# Altium project ACDC_Flyback.PrjPcb
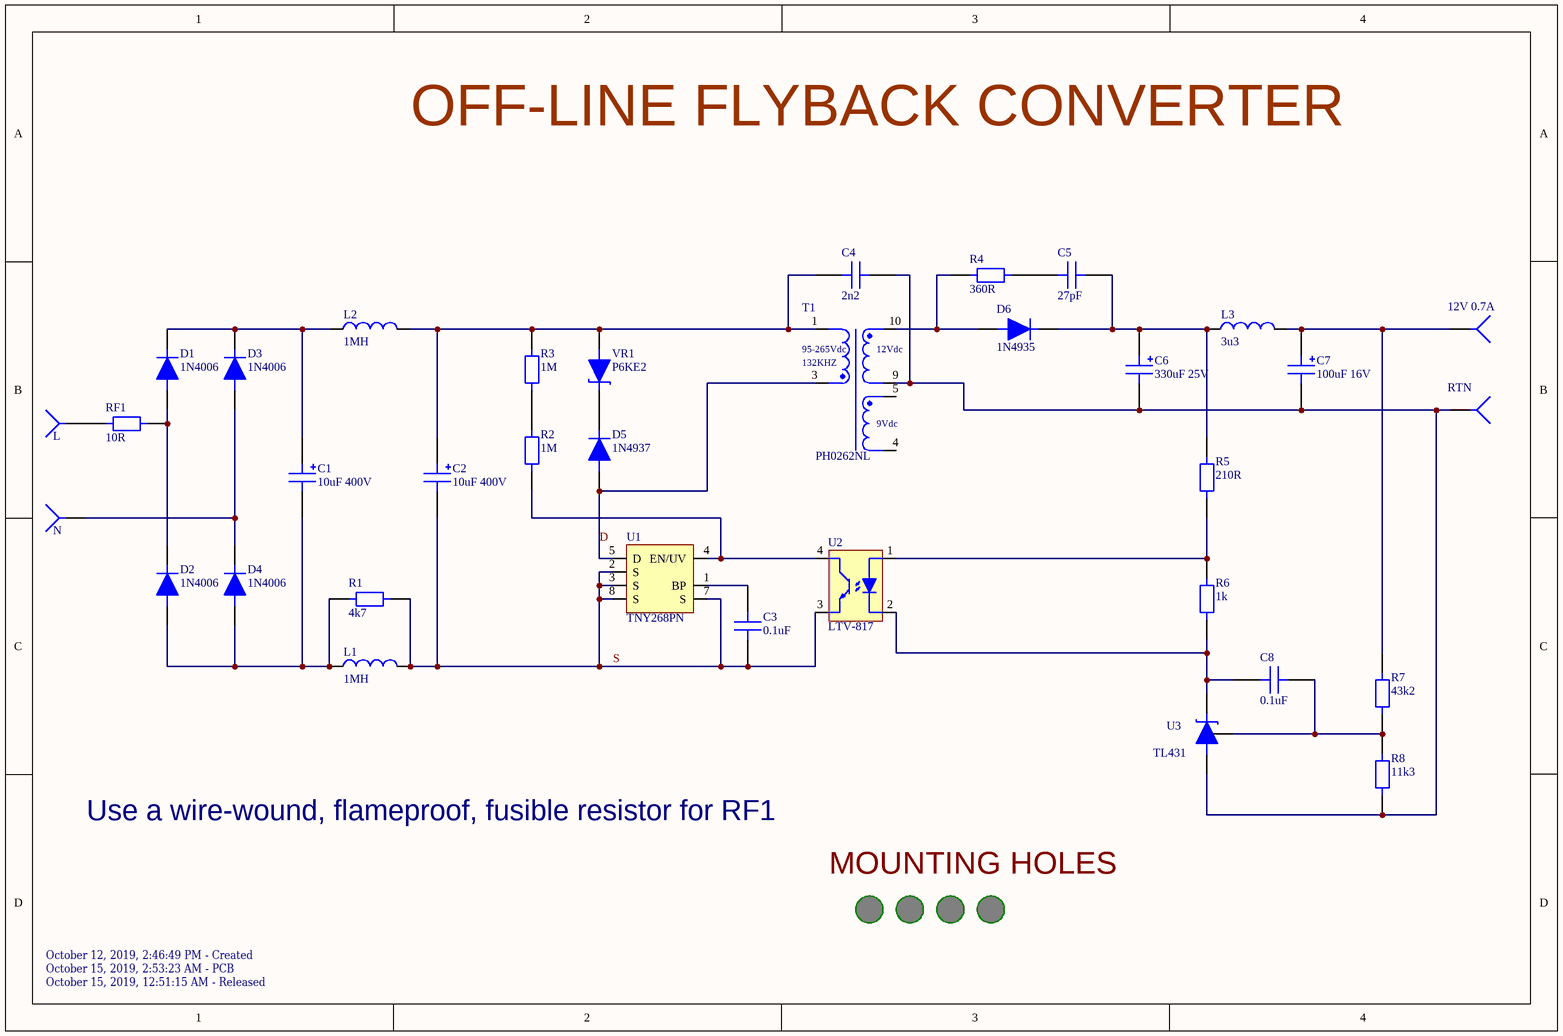
[diagram p0: ACDC_Flyback.SchDoc]
2 sheets, 39 parts. Net scope: global (net labels, ports and power ports of the same name join across sheets).
Board file: ACDC_Flyback.PcbDoc
Sheets:
  ACDC_Flyback.SchDoc
  Board Layout Recommendations.SchDoc

## Sheet ACDC_Flyback.SchDoc
size A4

### Parts
1  MNT HOLE 3.5mm  [MNT HOLE 3.5mm]  (value not drawn)  (no BOM)
2  MNT HOLE 3.5mm  [MNT HOLE 3.5mm]  (value not drawn)  (no BOM)
3  MNT HOLE 3.5mm  [MNT HOLE 3.5mm]  (value not drawn)  (no BOM)
4  MNT HOLE 3.5mm  [MNT HOLE 3.5mm]  (value not drawn)  (no BOM)
C1  10uF 400V  [CAP 10x20]
C2  10uF 400V  [CAP 10x20]
C3  0.1uF  [CAP CER 5mm]
C4  2n2  [CAP X1/Y1 9.5mm]
C5  27pF  [CAP CER 5mm]
C6  330uF 25V  [CAP 8x16]
C7  100uF 16V  [CAP 5x11]
C8  0.1uF  [CAP CER 5mm]
D1  1N4006  [Diode H 8.5mm]
D2  1N4006  [Diode H 8.5mm]
D3  1N4006  [Diode H 8.5mm]
D4  1N4006  [Diode H 8.5mm]
D5  1N4937  [Diode H 8.5mm]
D6  1N4935  [Diode H 8.5mm]
L1  1MH  [IND 4mm BLUE]
L2  1MH  [IND 4mm BLUE]
L3  3u3  [IND 4mm BLACK]
R1  4k7  [RES V 0.25W 5mm]
R2  1M  [RES H 0.25W 8.5mm]
R3  1M  [RES H 0.25W 8.5mm]
R4  360R  [RES V 0.25W 5mm]
R5  210R  [RES V 0.25W 5mm]
R6  1k  [RES V 0.25W 5mm]
R7  43k2  [RES V 0.25W 5mm]
R8  11k3  [RES V 0.25W 5mm]
RF1  10R  [RES V 2W 5mm]
T1  PH0262NL  [PH0262NL]
U1  TNY268PN  [DIP8]
U2  LTV-817  [LTV-8x7]
U3  TL431  [TO-92 (TO-226)]
VR1  P6KE2  [Diode H 8.5mm]
X1  L  [Power Terminal]  (no BOM)
X2  N  [Power Terminal]  (no BOM)
X3  12V 0.7A  [Power Terminal]  (no BOM)
X4  RTN  [Power Terminal]  (no BOM)

### Nets
D: D5.1 T1.3 U1.5(D)
S: C2.1 C3.1 L1.2 R1.2 U1.2(S) U1.3(S) U1.7(S) U1.8(S) U2.3
NetC1_1: C1.1 D2.1 D4.1 L1.1 R1.1
NetC1_2: C1.2 D1.2 D3.2 L2.1
NetC2_2: C2.2 C4.1 L2.2 R3.2 T1.1 VR1.1
NetC3_2: C3.2 U1.1(BP)
NetC4_2: C4.2 C6.1 C7.1 R8.1 T1.9 U3.2 X4.1
NetC5_1: C5.1 R4.2
NetC5_2: C5.2 C6.2 D6.2 L3.1 R5.1
NetC7_2: C7.2 L3.2 R7.2 X3.1
NetC8_1: C8.1 R6.1 U2.2 U3.3
NetC8_2: C8.2 R7.1 R8.2 U3.1
NetD1_1: D1.1 D2.2 RF1.2
NetD3_1: D3.1 D4.2 X2.1
NetD5_2: D5.2 VR1.2
NetD6_1: D6.1 R4.1 T1.10
NetR2_1: R2.1 U1.4(EN/UV) U2.4
NetR2_2: R2.2 R3.1
NetR5_2: R5.2 R6.2 U2.1
NetRF1_1: RF1.1 X1.1

Not connected (* = marked no-connect by the designer): T1 4 5

### Notes on the sheet
- OFF-LINE FLYBACK CONVERTER
- Use a wire-wound, flameproof, fusible resistor for RF1
- MOUNTING HOLES
- ‎October ‎12, ‎2019, ‏‎2:46:49 PM - Created
- ‎October ‎15, ‎2019, ‏‎2:53:23 AM - PCB
- ‎October ‎15, ‎2019, ‏‎12:51:15 AM - Released
- (in symbol PH0262NL) 95-265Vdc; 12Vdc; 132KHZ; 9Vdc

### Library data of the parts
C1 C2 = EKXG401ETD100MJ20S: CAP ALUM 10uF 400V 10x20; Manufacturer: United Chemi-Con; Tolerance: 20%; Ripple Current: 140mA; Polarity: Polar; Life (Hours): 8000Hour; Supplier 1: Digi-Key; Supplier Part Number 1: 565-4257-1-ND; Manufacturer Part Number: EKXG401ETD100MJ20S; Stock 1: 3749; Mount: Through Hole; Case/Package: Radial; Min Operating Temperature: -40°C; Max Operating Temperature: 105°C; Package Quantity: 800; Packaging: Tape and Reel; Capacitance: 10uF; Voltage Rating: 400V; Termination: Radial; Length: 20mm; Lead Pitch: 5mm; Height - Seated (Max): 0.846inch; ComponentLink1URL: http://www.chemi-con.co.jp/cgi-bin/CAT_DB/SEARCH/cat_db_al.cgi?e=e&j=p&pdfname=kxg&src-supplier=Digi-Key; ComponentLink1Description: http://www.chemi-con.co.jp/cgi-bin/CAT_DB/SEARCH/cat_db_al.cgi?e=e&j=p&pdfname=kxg&src-supplier=Digi-Key; ComponentLink2URL: http://www.onlinecomponents.com/datasheet/ekxg401etd100mj20s.aspx?p=12708479&src-supplier=Onlinecomponents.com; ComponentLink2Description: http://www.onlinecomponents.com/datasheet/ekxg401etd100mj20s.aspx?p=12708479&src-supplier=Onlinecomponents.com; ComponentLink3URL: http://www.mouser.com/ds/2/420/-794782.pdf?src-supplier=Mouser; ComponentLink3Description: http://www.mouser.com/ds/2/420/-794782.pdf?src-supplier=Mouser; Category: Capasitors
C3 C8 = K104K15X7RF5TL2: CAP CER 0.1UF 50V X7R RADIAL; Manufacturer: Vishay BCcomponents; Dielectric Material: Ceramic; Capacitance: 100nF; Tolerance: 10%; Lead/Base Style: Straight; Lead Diameter: 0.5mm; Lead Length: 30mm; Supplier 1: Digi-Key; Supplier Part Number 1: BC1084CT-ND; Manufacturer Part Number: K104K15X7RF5TL2; Stock 1: 40474; Mount: Through Hole,PCB; Case/Package: Dipped; Number of Pins: 2; Weight: 0.005291oz; Contact Plating: Tin; Min Operating Temperature: -55°C; Max Operating Temperature: 125°C; Voltage Rating: 50V; Package Quantity: 4000; Packaging: Tape and Reel; Dielectric: X7R; Voltage Rating (DC): 50V; Termination: Radial; Voltage: 50V; Diameter: 500um; Length: 4mm; Height: 4mm; Width: 0.098inch; Lead Pitch: 2.5mm; Height - Seated (Max): 0.22inch; Depth: 2.6mm; Thickness: 2.6mm; Radiation Hardening: No; REACH SVHC: Unknown; Lead Free: Lead Free; ComponentLink1URL: http://www.vishay.com/docs/45171/kseries.pdf?src-supplier=Digi-Key; ComponentLink1Description: http://www.vishay.com/docs/45171/kseries.pdf?src-supplier=Digi-Key; ComponentLink2URL: http://components.arrow.com/part/dataview/4566668S9851583N4052?src-supplier=Arrow; ComponentLink2Description: http://components.arrow.com/part/dataview/4566668S9851583N4052?src-supplier=Arrow; ComponentLink3URL: http://www.mouser.com/ds/2/427/kvseries-1097555.pdf?src-supplier=Mouser; ComponentLink3Description: http://www.mouser.com/ds/2/427/kvseries-1097555.pdf?src-supplier=Mouser; ComponentLink4URL: https://www.alliedelec.com/m/d/0a55132c315b03541979b2302407a53b.pdf?src-supplier=Allied+Electronics; ComponentLink4Description: https://www.alliedelec.com/m/d/0a55132c315b03541979b2302407a53b.pdf?src-supplier=Allied+Electronics; ComponentLink5URL: https://www.verical.com/server-webapp/html/getDatasheet?partID=35651&src-supplier=Verical; ComponentLink5Description: https://www.verical.com/server-webapp/html/getDatasheet?partID=35651&src-supplier=Verical; ComponentLink6URL: http://www.farnell.com/datasheets/2608733.pdf?src-supplier=Farnell; ComponentLink6Description: http://www.farnell.com/datasheets/2608733.pdf?src-supplier=Farnell; ComponentLink7URL: http://www.farnell.com/datasheets/2045807.pdf?src-supplier=Element14; ComponentLink7Description: http://www.farnell.com/datasheets/2045807.pdf?src-supplier=Element14; Category: Capacitors
C4 = 440LD22-R: CAP CER 2u2 X1/Y1 400VAC/500VAC Y5U 20% (10.9 X 5.7mm) Radial 9.5mm Bulk; Manufacturer: Vishay; Capacitance: 2.2nF; Voltage Rating (AC): 500V; Dissipation Factor: 2%; Lead/Base Style: Straight; Lead Diameter: 0.81mm; Ratings: X1,Y1; Supplier 1: Digi-Key; Supplier Part Number 1: BC3229-ND; Manufacturer Part Number: 440LD22-R; Stock 1: 0; Mount: Through Hole,PCB; Case/Package: Radial; Contact Plating: Tin; Min Operating Temperature: -30°C; Max Operating Temperature: 125°C; Tolerance: 20%; Dielectric: Y5U; Package Quantity: 250; Termination: Radial; Packaging: Bulk; Composition: Ceramic; Voltage: 500V; Diameter: 10.9mm; Height: 5.7mm; Lead Pitch: 9.5mm; Height - Seated (Max): 0.555inch; Depth: 5.7mm; Radiation Hardening: No; Lead Free: Lead Free; ComponentLink1URL: https://www.alliedelec.com/m/d/8418b65e1fb6842b96172f5a3b1dd544.pdf?src-supplier=Allied+Electronics; ComponentLink1Description: https://www.alliedelec.com/m/d/8418b65e1fb6842b96172f5a3b1dd544.pdf?src-supplier=Allied+Electronics; ComponentLink2URL: https://www.verical.com/server-webapp/html/getDatasheet?partID=310202&src-supplier=Verical; ComponentLink2Description: https://www.verical.com/server-webapp/html/getDatasheet?partID=310202&src-supplier=Verical; ComponentLink3URL: http://www.vishay.com/docs/23102/440lseries.pdf?src-supplier=Digi-Key; ComponentLink3Description: http://www.vishay.com/docs/23102/440lseries.pdf?src-supplier=Digi-Key; ComponentLink4URL: http://www.mouser.com/ds/2/427/440lseries-239711.pdf?src-supplier=Mouser; ComponentLink4Description: http://www.mouser.com/ds/2/427/440lseries-239711.pdf?src-supplier=Mouser; Category: Capacitors
C5 = RCE5C2A270J0M1H03A: CAP CER 27pF 100V C0G/NP0 RADIAL; Manufacturer: Murata; Tolerance: 5%; Dielectric: C0G; Lead/Base Style: Formed Leads; Lead Diameter: 0.5mm; Supplier 1: Digi-Key; Supplier Part Number 1: 490-7451-1-ND; Manufacturer Part Number: RCE5C2A270J0M1H03A; Stock 1: 7163; Mount: Through Hole; Case/Package: Radial; Min Operating Temperature: -55°C; Max Operating Temperature: 125°C; Capacitance: 27pF; Voltage Rating (DC): 100V; Package Quantity: 2000; Packaging: Tape and Reel; Voltage Rating: 100V; Termination: Radial; Composition: Ceramic; Length: 0.142inch; Height: 3.5mm; Width: 0.098inch; Lead Pitch: 0.197inch; Height - Seated (Max): 0.138inch; Ratings: AEC-Q200; ComponentLink1URL: http://search.murata.co.jp/Ceramy/image/img/A01X/CNRPEE.pdf?src-supplier=Digi-Key; ComponentLink1Description: http://search.murata.co.jp/Ceramy/image/img/A01X/CNRPEE.pdf?src-supplier=Digi-Key; Category: Capasitors
C6 = ESY337M025AG8AA: CAP ALUM 330uF 25V 20% 105C Radial 8x16 Aluminum Electrolytic Capacitors; Manufacturer: KEMET; Dielectric Material: Aluminium; Ripple Current: 700mA; Impedance: 56mR; Leakage Current: 82uA; Life (Hours): 3000Hour; Dissipation Factor: 0.14%; Lead/Base Style: Straight; Lead Diameter: 0.6mm; Lead Length: 20mm; Supplier 1: Digi-Key; Supplier Part Number 1: 399-6125-ND; Manufacturer Part Number: ESY337M025AG8AA; Stock 1: 2532; Mount: Through Hole,PCB; Case/Package: Radial; Min Operating Temperature: -40°C; Max Operating Temperature: 105°C; Capacitance: 330uF; Tolerance: 20%; Package Quantity: 5000; Voltage Rating: 25V; Packaging: Bulk; Voltage Rating (DC): 25V; Termination: Radial; Voltage: 25V; ESR (Equivalent Series Resistance): 56mR; Diameter: 8mm; Length: 16mm; Height: 16mm; Lead Pitch: 3.5mm; Height - Seated (Max): 0.709inch; Radiation Hardening: No; ComponentLink1URL: http://capacitoredge.kemet.com/capedge2/DataSheet?pn=ESY337M025AG8AA&src-supplier=Avnet; ComponentLink1Description: http://capacitoredge.kemet.com/capedge2/DataSheet?pn=ESY337M025AG8AA&src-supplier=Avnet; ComponentLink2URL: http://uk.rs-online.com/webdocs/1443/0900766b81443d12.pdf?src-supplier=RSComponents; ComponentLink2Description: http://uk.rs-online.com/webdocs/1443/0900766b81443d12.pdf?src-supplier=RSComponents; ComponentLink3URL: https://search.kemet.com/component-edge/download/specsheet/ESY337M025AG8AA.pdf?src-supplier=Digi-Key; ComponentLink3Description: https://search.kemet.com/component-edge/download/specsheet/ESY337M025AG8AA.pdf?src-supplier=Digi-Key; ComponentLink4URL: http://capacitoredge.kemet.com/capedge2/DataSheet?pn=ESY337M025AG8AA&src-supplier=Avnet+Europe; ComponentLink4Description: http://capacitoredge.kemet.com/capedge2/DataSheet?pn=ESY337M025AG8AA&src-supplier=Avnet+Europe; ComponentLink5URL: https://www.alliedelec.com/m/d/e4a14f479f712247b3f3335e27a86e2b.pdf?src-supplier=Allied+Electronics; ComponentLink5Description: https://www.alliedelec.com/m/d/e4a14f479f712247b3f3335e27a86e2b.pdf?src-supplier=Allied+Electronics; ComponentLink6URL: http://www.mouser.com/ds/2/212/KEM_A4007_ESY-1103537.pdf?src-supplier=Mouser; ComponentLink6Description: http://www.mouser.com/ds/2/212/KEM_A4007_ESY-1103537.pdf?src-supplier=Mouser; Category: Capacitors
C7 = ESL107M016AC3AA: CAP ALUM 100UF 16V 20% THRU HOLE; Manufacturer: KEMET; Polarity: Polar; ESR (Equivalent Series Resistance): 230mR; Life (Hours): 8000Hour; Supplier 1: Digi-Key; Supplier Part Number 1: 399-15740-ND; Manufacturer Part Number: ESL107M016AC3AA; Stock 1: 28659; Mount: Through Hole; Case/Package: Radial; Min Operating Temperature: -40°C; Max Operating Temperature: 105°C; Packaging: Bulk; Capacitance: 100uF; Tolerance: 20%; Voltage Rating: 16V; ComponentLink1URL: https://api.kemet.com/component-edge/download/datasheet/ESL107M016AC3AA.pdf?src-supplier=Digi-Key; ComponentLink1Description: https://api.kemet.com/component-edge/download/datasheet/ESL107M016AC3AA.pdf?src-supplier=Digi-Key; Category: Capacitors
D1-D4 = 1N4006E354: DIODE 1N4006 GEN PURP 800V 1A DO204AL; Manufacturer: Vishay Intertechnology; Forward Voltage: 1.1V; Peak Non-Repetitive Surge Current: 45A; Element Configuration: Single; Polarity: Standard; Capacitance: 15pF; Supplier 1: Digi-Key; Supplier Part Number 1: 1N4006-E3/54GITR-ND; Manufacturer Part Number: 1N4006E354; Stock 1: 0; Mount: Through Hole; Number of Pins: 2; Min Operating Temperature: -50°C; Max Operating Temperature: 150°C; Packaging: Tape and Reel; Voltage Rating (DC): 800V; Current Rating: 1A; Output Current: 1A; Radiation Hardening: No; Lead Free: Lead Free; ComponentLink1URL: https://www.verical.com/server-webapp/html/getDatasheet?partID=770984&src-supplier=Verical; ComponentLink1Description: https://www.verical.com/server-webapp/html/getDatasheet?partID=770984&src-supplier=Verical; Category: Diodes
D5 = 1N4937GP-E3/73: DIODE 1N4937 Rectifiers 1.0 Amp 600 Volt Glass Passivated; Manufacturer: Vishay Semiconductors; Peak Reverse Current: 5uA; Max Surge Current: 30A; Recovery Time: 200ns; Average Rectified Current: 1A; Max Repetitive Reverse Voltage (Vrrm): 600V; Element Configuration: Single; Supplier 1: Digi-Key; Supplier Part Number 1: 1N4937GP-E3/73GICT-ND; Manufacturer Part Number: 1N4937GP-E3/73; Stock 1: 12000; Mount: Through Hole; Number of Pins: 2; Contact Plating: Tin,Matte; Min Operating Temperature: -65°C; Max Operating Temperature: 175°C; Packaging: Tape and Reel; Package Quantity: 3000; Reverse Recovery Time: 200ns; Peak Non-Repetitive Surge Current: 30A; Reverse Voltage: 600V; Max Reverse Voltage (DC): 600V; Radiation Hardening: No; ComponentLink1URL: http://www.vishay.com/docs/88509/1n4933gp.pdf?src-supplier=Avnet+Europe; ComponentLink1Description: http://www.vishay.com/docs/88509/1n4933gp.pdf?src-supplier=Avnet+Europe; ComponentLink2URL: http://www.vishay.com/docs/88509/1n4933gp.pdf?src-supplier=Digi-Key; ComponentLink2Description: http://www.vishay.com/docs/88509/1n4933gp.pdf?src-supplier=Digi-Key; Category: Diodes
D6 = 1N4935-E3/54: DIODE 1N4935 Rectifiers 1.0 Amp 200 Volt; Manufacturer: Vishay Semiconductors; Max Surge Current: 30A; Recovery Time: 200ns; Forward Voltage: 1.2V; Forward Current: 1A; Peak Reverse Current: 5uA; Max Repetitive Reverse Voltage (Vrrm): 200V; Element Configuration: Single; Supplier 1: Digi-Key; Supplier Part Number 1: 1N4935-E3/54GICT-ND; Manufacturer Part Number: 1N4935-E3/54; Stock 1: 13746; Mount: Through Hole; Number of Pins: 2; Min Operating Temperature: -50°C; Max Operating Temperature: 150°C; Package Quantity: 1; Packaging: Tape and Reel; Average Rectified Current: 1A; Reverse Recovery Time: 200ns; Max Forward Surge Current (Ifsm): 30A; Peak Non-Repetitive Surge Current: 30A; Current: 1A; Voltage: 200V; Reverse Voltage: 200V; Max Reverse Voltage (DC): 200V; Diameter: 2.7mm; Length: 0.204inch; Radiation Hardening: No; REACH SVHC: Unknown; Lead Free: Lead Free; ComponentLink1URL: http://www.vishay.com/docs/88508/1n4933.pdf?src-supplier=Digi-Key; ComponentLink1Description: http://www.vishay.com/docs/88508/1n4933.pdf?src-supplier=Digi-Key; ComponentLink2URL: https://www.verical.com/server-webapp/html/getDatasheet?partID=249870&src-supplier=Verical; ComponentLink2Description: https://www.verical.com/server-webapp/html/getDatasheet?partID=249870&src-supplier=Verical; ComponentLink3URL: http://www.vishay.com/docs/88508/1n4933.pdf?src-supplier=Future+Electronics; ComponentLink3Description: http://www.vishay.com/docs/88508/1n4933.pdf?src-supplier=Future+Electronics; ComponentLink4URL: https://www.alliedelec.com/m/d/1dbe1470819963bfa21f0af49fac4c8c.pdf?src-supplier=Allied+Electronics; ComponentLink4Description: https://www.alliedelec.com/m/d/1dbe1470819963bfa21f0af49fac4c8c.pdf?src-supplier=Allied+Electronics; ComponentLink5URL: http://www.vishay.com/docs/88508/1n4933.pdf?src-supplier=Avnet; ComponentLink5Description: http://www.vishay.com/docs/88508/1n4933.pdf?src-supplier=Avnet; ComponentLink6URL: http://www.vishay.com/docs/88508/1n4933.pdf?src-supplier=Avnet+Europe; ComponentLink6Description: http://www.vishay.com/docs/88508/1n4933.pdf?src-supplier=Avnet+Europe; Category: Diodes
L1 L2 = SBC2-102-181: IND 1MH 180MA 4 OHM TH; Manufacturer: KEMET; Core Material: Ferrite; DC Resistance (DCR): 4R; Test Frequency: 10kHz; Tolerance: 10%; Saturation Current: 210mA; Shielding: Unshielded; Supplier 1: Digi-Key; Supplier Part Number 1: 399-18899-ND; Manufacturer Part Number: SBC2-102-181; Stock 1: 0; Mount: Through Hole; Case/Package: Radial; Packaging: Bulk; Inductance: 1mH; Composition: Wirewound; Current Rating: 180mA; Height - Seated (Max): 0.413inch; ComponentLink1URL: http://www.kemet.com/Lists/ProductCatalog/Attachments/606/KEM_L9007_SBC.pdf?src-supplier=Digi-Key; ComponentLink1Description: http://www.kemet.com/Lists/ProductCatalog/Attachments/606/KEM_L9007_SBC.pdf?src-supplier=Digi-Key; Category: Inductors
L3 = RL622-3R3K-RC: IND 3u3 5.5A 25 MOHM TH; Manufacturer: Bourns; Core Material: Ferrite; Self Resonant Frequency: 79MHz; Tolerance: 10%; Q Factor: 20; Inductance: 3.3uH; Shielding: Unshielded; DC Resistance (DCR): 25mR; Test Frequency: 7.96MHz; Lead/Base Style: Radial; Lead Diameter: 0.62mm; Lead Length: 5mm; Supplier 1: Digi-Key; Supplier Part Number 1: M9978-ND; Manufacturer Part Number: RL622-3R3K-RC; Stock 1: 14097; Mount: Through Hole,Radial; Case/Package: Radial; Number of Pins: 2; Min Operating Temperature: -55°C; Max Operating Temperature: 105°C; Packaging: Bulk; Package Quantity: 100; Termination: Radial; Orientation: Vertical; Inductance Tolerance: 10%; Current Rating: 5.5A; Max DC Current: 5.5A; Composition: Wirewound; DC Current: 5.5A; Military Standard: Not; RMS Current (Irms): 5.5A; Diameter: 8.5mm; Height: 11mm; Width: 8.5mm; Lead Pitch: 5mm; Height - Seated (Max): 0.433inch; Radiation Hardening: No; Lead Free: Lead Free; REACH SVHC: No SVHC; ComponentLink1URL: http://www.mouser.com/ds/2/54/RL622_series-38677.pdf?src-supplier=Mouser; ComponentLink1Description: http://www.mouser.com/ds/2/54/RL622_series-38677.pdf?src-supplier=Mouser; ComponentLink2URL: http://www.bourns.com/data/global/pdfs/rl622_series.pdf?src-supplier=Avnet; ComponentLink2Description: http://www.bourns.com/data/global/pdfs/rl622_series.pdf?src-supplier=Avnet; ComponentLink3URL: http://www.farnell.com/datasheets/1695387.pdf?src-supplier=Element14; ComponentLink3Description: http://www.farnell.com/datasheets/1695387.pdf?src-supplier=Element14; ComponentLink4URL: http://www.bourns.com/data/global/pdfs/rl622_series.pdf?src-supplier=Avnet+Europe; ComponentLink4Description: http://www.bourns.com/data/global/pdfs/rl622_series.pdf?src-supplier=Avnet+Europe; ComponentLink5URL: http://uk.rs-online.com/webdocs/0fa5/0900766b80fa594f.pdf?src-supplier=RSComponents; ComponentLink5Description: http://uk.rs-online.com/webdocs/0fa5/0900766b80fa594f.pdf?src-supplier=RSComponents; ComponentLink6URL: https://www.bourns.com/docs/Product-Datasheets/rl622_series.pdf?src-supplier=Digi-Key; ComponentLink6Description: https://www.bourns.com/docs/Product-Datasheets/rl622_series.pdf?src-supplier=Digi-Key; Category: Inductors
R1 = CFR-25JB-52-4K7: RES T/H 4k7 OHM 1/4W 5% AXIAL; Manufacturer: Yageo; Resistance: 4.7kR; Power Rating: 250mW; Temperature Coefficient: 500ppm/°C; Supplier 1: Digi-Key; Supplier Part Number 1: 4.7KQBK-ND; Manufacturer Part Number: CFR-25JB-52-4K7; Stock 1: 133689; Case/Package: Axial; Min Operating Temperature: -55°C; Max Operating Temperature: 155°C; Tolerance: 5%; Package Quantity: 200; Packaging: Bulk; Composition: Carbon Film; Number of Terminations: 2; Max Power Dissipation: 250mW; Length: 0.248inch; Lead Free: Lead Free; ComponentLink1URL: http://www.yageo.com/NewPortal/yageodocoutput?fileName=/pdf/throughhole/Yageo_LR_CFR_2013.pdf&src-supplier=Digi-Key; ComponentLink1Description: http://www.yageo.com/NewPortal/yageodocoutput?fileName=/pdf/throughhole/Yageo_LR_CFR_2013.pdf&src-supplier=Digi-Key; ComponentLink2URL: http://www.yageo.com/documents/recent/General%20Type_CFR.pdf?src-supplier=Future+Electronics; ComponentLink2Description: http://www.yageo.com/documents/recent/General%20Type_CFR.pdf?src-supplier=Future+Electronics; Category: Resistors
R2 R3 = CFR-25JB-52-1M: RES T/H 1M OHM 1/4W 5% AXIAL; Manufacturer: Yageo; Resistance: 1MR; Temperature Coefficient: -1500ppm/°C; Max Power Dissipation: 250mW; Supplier 1: Digi-Key; Supplier Part Number 1: 1.0MQBK-ND; Manufacturer Part Number: CFR-25JB-52-1M; Stock 1: 156783; Case/Package: Axial; Min Operating Temperature: -55°C; Max Operating Temperature: 155°C; Tolerance: 5%; Package Quantity: 200; Packaging: Bulk; Composition: Carbon Film; Number of Terminations: 2; Power Rating: 250mW; Length: 0.248inch; Lead Free: Lead Free; ComponentLink1URL: http://www.yageo.com/documents/recent/General%20Type_CFR.pdf?src-supplier=Future+Electronics; ComponentLink1Description: http://www.yageo.com/documents/recent/General%20Type_CFR.pdf?src-supplier=Future+Electronics; ComponentLink2URL: http://www.yageo.com/NewPortal/yageodocoutput?fileName=/pdf/throughhole/Yageo_LR_CFR_2013.pdf&src-supplier=Digi-Key; ComponentLink2Description: http://www.yageo.com/NewPortal/yageodocoutput?fileName=/pdf/throughhole/Yageo_LR_CFR_2013.pdf&src-supplier=Digi-Key; Category: Resistors
R4 = CFR-25JB-52-360R: RES T/H 360 OHM 1/4W 5% AXIAL; Manufacturer: Yageo; Temperature Coefficient: 500ppm/°C; Max Power Dissipation: 250mW; Supplier 1: Digi-Key; Supplier Part Number 1: 360QBK-ND; Manufacturer Part Number: CFR-25JB-52-360R; Stock 1: 30687; Case/Package: Axial; Min Operating Temperature: -55°C; Max Operating Temperature: 155°C; Package Quantity: 200; Packaging: Bulk; Resistance: 360R; Tolerance: 5%; Composition: Carbon Film; Number of Terminations: 2; Length: 0.248inch; ComponentLink1URL: http://www.yageo.com/NewPortal/yageodocoutput?fileName=/pdf/throughhole/Yageo_LR_CFR_2013.pdf&src-supplier=Digi-Key; ComponentLink1Description: http://www.yageo.com/NewPortal/yageodocoutput?fileName=/pdf/throughhole/Yageo_LR_CFR_2013.pdf&src-supplier=Digi-Key; Category: Resistors
R5 = MFR-25FBF52-210R: RES T/H 210 OHM 1/4W 1%; Manufacturer: Yageo; Power Rating: 250mW; Voltage Rating: 250V; Temperature Coefficient: 100ppm/°C; Voltage Rating (DC): 200V; Supplier 1: Digi-Key; Supplier Part Number 1: 210XBK-ND; Manufacturer Part Number: MFR-25FBF52-210R; Stock 1: 9695; Mount: Through Hole; Case/Package: Axial; Min Operating Temperature: -55°C; Max Operating Temperature: 155°C; Package Quantity: 200; Packaging: Bulk; Resistance: 210R; Tolerance: 1%; Composition: Metal Film; Number of Terminations: 2; Termination: Axial; Max Power Dissipation: 250mW; Length: 0.248inch; ComponentLink1URL: http://www.yageo.com/documents/recent/Yageo%20LR_MFR_2013.pdf?src-supplier=Digi-Key; ComponentLink1Description: http://www.yageo.com/documents/recent/Yageo%20LR_MFR_2013.pdf?src-supplier=Digi-Key; Category: Resistors
R6 = MFR-25FBF52-1K: RES T/H 1K OHM 1/4W 1%; Manufacturer: Yageo; Resistance: 1kR; Power Rating: 250mW; Voltage Rating: 250V; Temperature Coefficient: 100ppm/°C; Voltage Rating (DC): 200V; Lead Diameter: 0.6mm; Supplier 1: Digi-Key; Supplier Part Number 1: 1.00KXBK-ND; Manufacturer Part Number: MFR-25FBF52-1K; Stock 1: 94485; Mount: Through Hole; Case/Package: Axial; Min Operating Temperature: -55°C; Max Operating Temperature: 155°C; Tolerance: 1%; Packaging: Bulk; Package Quantity: 200; Composition: Metal Film; Termination: Axial; Number of Terminations: 2; Max Power Dissipation: 250mW; Length: 0.248inch; Width: 6.3mm; Lead Free: Lead Free; ComponentLink1URL: http://www.yageo.com/documents/recent/Yageo%20LR_MFR_2013.pdf?src-supplier=Digi-Key; ComponentLink1Description: http://www.yageo.com/documents/recent/Yageo%20LR_MFR_2013.pdf?src-supplier=Digi-Key; Category: Resistors
R7 = MFR-25FBF52-43K2: RES T/H 43k2 OHM 1/4W 1%; Manufacturer: Yageo; Resistance: 43.2kR; Power Rating: 250mW; Voltage Rating: 250V; Temperature Coefficient: 100ppm/°C; Voltage Rating (DC): 200V; Lead Diameter: 0.6mm; Supplier 1: Digi-Key; Supplier Part Number 1: 43.2KXBK-ND; Manufacturer Part Number: MFR-25FBF52-43K2; Stock 1: 5915; Mount: Through Hole; Case/Package: Axial; Min Operating Temperature: -55°C; Max Operating Temperature: 155°C; Tolerance: 1%; Packaging: Bulk; Package Quantity: 200; Composition: Metal Film; Termination: Axial; Number of Terminations: 2; Max Power Dissipation: 250mW; Length: 0.248inch; Width: 6.3mm; ComponentLink1URL: http://www.yageo.com/documents/recent/Yageo%20LR_MFR_2013.pdf?src-supplier=Digi-Key; ComponentLink1Description: http://www.yageo.com/documents/recent/Yageo%20LR_MFR_2013.pdf?src-supplier=Digi-Key; Category: Resistors
R8 = MFR-25FBF52-11K3: RES T/H 11k3 OHM 1/4W 1% Metal Film; Manufacturer: Yageo; Resistance: 11.3kR; Power Rating: 250mW; Voltage Rating: 250V; Temperature Coefficient: 100ppm/°C; Voltage Rating (DC): 200V; Supplier 1: Digi-Key; Supplier Part Number 1: 11.3KXBK-ND; Manufacturer Part Number: MFR-25FBF52-11K3; Stock 1: 4405; Case/Package: Axial; Min Operating Temperature: -55°C; Max Operating Temperature: 155°C; Tolerance: 1%; Packaging: Bulk; Package Quantity: 200; Termination: Axial; Composition: Metal Film; Number of Terminations: 2; Max Power Dissipation: 250mW; Length: 0.248inch; ComponentLink1URL: http://www.yageo.com/documents/recent/Yageo%20LR_MFR_2013.pdf?src-supplier=Digi-Key; ComponentLink1Description: http://www.yageo.com/documents/recent/Yageo%20LR_MFR_2013.pdf?src-supplier=Digi-Key; Category: Resistors
RF1 = FW20A10R0JA: RES T/H 10 OHM 2W Wirewound 5% ±200ppm/C Conformal AXL Ammo Pack; Manufacturer: Bourns; Voltage Rating: 240V; Threshold Voltage: 4.5V; Temperature Coefficient: 200ppm/°C; Lead Diameter: 0.65mm; Supplier 1: Digi-Key; Supplier Part Number 1: FW20A10R0JACT-ND; Manufacturer Part Number: FW20A10R0JA; Stock 1: 16366; Case/Package: Axial; Min Operating Temperature: -55°C; Max Operating Temperature: 155°C; Package Quantity: 1; Resistance: 10R; Power Rating: 2W; Tolerance: 5%; Packaging: Tape and Reel; Composition: Wirewound; Number of Terminations: 2; Termination: Axial; Military Standard: Not; Max Power Dissipation: 2W; Voltage Rating (DC): 240V; Diameter: 6mm; Length: 12mm; REACH SVHC: Unknown; Lead Free: Lead Free; ComponentLink1URL: http://www.bourns.com/docs/Product-Datasheets/FW.pdf?src-supplier=Digi-Key; ComponentLink1Description: http://www.bourns.com/docs/Product-Datasheets/FW.pdf?src-supplier=Digi-Key; ComponentLink2URL: http://www.mouser.com/ds/2/54/w-777661.pdf?src-supplier=Mouser; ComponentLink2Description: http://www.mouser.com/ds/2/54/w-777661.pdf?src-supplier=Mouser; ComponentLink3URL: http://www.farnell.com/datasheets/1835149.pdf?src-supplier=Element14; ComponentLink3Description: http://www.farnell.com/datasheets/1835149.pdf?src-supplier=Element14; Category: Resistors
T1 = PH0262NL: Transformer 3000Vrms 95V/265V Prim. 12V/9V Sec. Through Hole; Manufacturer: Pulse; Power Rating: 60W; Supplier 1: Digi-Key; Supplier Part Number 1: PH0262NL-ND; Manufacturer Part Number: PH0262NL; Stock 1: 0; Mount: Through Hole; ComponentLink1URL: http://productfinder.pulseeng.com/products/datasheets/P724.pdf?src-supplier=Avnet; ComponentLink1Description: http://productfinder.pulseeng.com/products/datasheets/P724.pdf?src-supplier=Avnet; Category: Transformers
U1 = TNY268PN: IC TNY268PN OFF LINE SWITCHER, DIP8, 268; Manufacturer: Power Integrations; Number of Outputs: 1; Output Current: 588mA; Output Voltage: 5.8V; Max Supply Voltage (AC): 265V; Min Supply Voltage (AC): 85V; Switching Frequency: 132kHz; Output Power: 15W; Max Duty Cycle: 68%; Operating Supply Current: 380uA; Max Output Current: 880mA; Max Power Dissipation: 23W; Breakdown Voltage: 700V; Topology: Flyback; Output Type: Adjustable; Supplier 1: Digi-Key; Supplier Part Number 1: 596-1055-5-ND; Manufacturer Part Number: TNY268PN; Stock 1: 13651; Mount: Through Hole; Case/Package: DIP; Number of Pins: 7; Weight: 0.080001oz; Min Operating Temperature: -40°C; Max Operating Temperature: 150°C; Packaging: Rail/Tube; Package Quantity: 50; Length: 9.83mm; Height: 3.68mm; Width: 6.6mm; Radiation Hardening: No; REACH SVHC: No SVHC; Lead Free: Lead Free; ComponentLink1URL: http://www.farnell.com/datasheets/1816307.pdf?src-supplier=Element14; ComponentLink1Description: http://www.farnell.com/datasheets/1816307.pdf?src-supplier=Element14; ComponentLink2URL: https://www.power.com/sites/default/files/product-docs/tny263_268.pdf?src-supplier=Digi-Key; ComponentLink2Description: https://www.power.com/sites/default/files/product-docs/tny263_268.pdf?src-supplier=Digi-Key; ComponentLink3URL: https://www.distrelec.biz/Web/Downloads/gn/_e/tfTNY263PN-to-TNY268GN_e.pdf?mime=application%2Fpdf&src-supplier=Distrelec; ComponentLink3Description: https://www.distrelec.biz/Web/Downloads/gn/_e/tfTNY263PN-to-TNY268GN_e.pdf?mime=application%2Fpdf&src-supplier=Distrelec; Category: Integrated Circuits
U2 = LTV-817-A: OPT DC-IN 1-CH Transistor DC-OUT 4-Pin PDIP; Manufacturer: Vishay Lite-On; Reverse Breakdown Voltage: 6V; Forward Voltage: 1.4V; Forward Current: 50mA; Rise Time: 18000ns; Number of Channels: 1; Power Dissipation: 200mW; Collector Emitter Saturation Voltage: 200mV; Max Collector Current: 8mA; Isolation Voltage: 5kV; Max Output Voltage: 35V; Current Transfer Ratio: 160%; Supplier 1: Digi-Key; Supplier Part Number 1: 160-2037-5-ND; Manufacturer Part Number: LTV-817-A; Stock 1: 12008; Mount: Through Hole; Case/Package: PDIP; Number of Pins: 4; Min Operating Temperature: -30°C; Max Operating Temperature: 100°C; Number of Elements: 1; Fall Time: 18000ns; Collector Emitter Voltage (VCEO): 35V; Radiation Hardening: No; ComponentLink1URL: https://www.verical.com/server-webapp/html/getDatasheet?partID=119517&src-supplier=Verical; ComponentLink1Description: https://www.verical.com/server-webapp/html/getDatasheet?partID=119517&src-supplier=Verical; ComponentLink2URL: http://www1.futureelectronics.com/doc/LITE-ON/LTV-817-A.pdf?src-supplier=Future+Electronics; ComponentLink2Description: http://www1.futureelectronics.com/doc/LITE-ON/LTV-817-A.pdf?src-supplier=Future+Electronics; Category: Optoisolators
U3 = TL431ACLPRAG: IC TL431 VREF SHUNT ADJ TO92-3; Manufacturer: ON Semiconductor; Current Rating: 500uA; Tolerance: 1%; Number of Channels: 1; Output Voltage: 36V; Max Input Voltage: 37V; Max Output Current: 100mA; Temperature Coefficient: 50ppm/°C; Cathode Current: 1mA; Reference Type: Shunt,Adjustable; Supplier 1: Digi-Key; Supplier Part Number 1: TL431ACLPRAGOSCT-ND; Manufacturer Part Number: TL431ACLPRAG; Stock 1: 6334; Mount: Through Hole; Case/Package: TO-92-3; Number of Pins: 3; Min Operating Temperature: 0°C; Max Operating Temperature: 70°C; Package Quantity: 1; Packaging: Tape and Reel; Output Current: 100mA; Reference Voltage: 36V; Max Output Voltage: 36V; Accuracy: 1%; Radiation Hardening: No; REACH SVHC: No SVHC; Lead Free: Lead Free; Halogen Free: Halogen Free; ComponentLink1URL: http://www.onsemi.com/pub/Collateral/TL431-D.PDF?src-supplier=Digi-Key; ComponentLink1Description: http://www.onsemi.com/pub/Collateral/TL431-D.PDF?src-supplier=Digi-Key; ComponentLink2URL: http://www.onsemi.com/pub_link/Collateral/TL431-D.PDF?src-supplier=Avnet; ComponentLink2Description: http://www.onsemi.com/pub_link/Collateral/TL431-D.PDF?src-supplier=Avnet; ComponentLink3URL: http://www.onsemi.com/pub/Collateral/TL431-D.PDF?src-supplier=Future+Electronics; ComponentLink3Description: http://www.onsemi.com/pub/Collateral/TL431-D.PDF?src-supplier=Future+Electronics; ComponentLink4URL: http://www.farnell.com/datasheets/2118317.pdf?src-supplier=Element14; ComponentLink4Description: http://www.farnell.com/datasheets/2118317.pdf?src-supplier=Element14; ComponentLink5URL: http://www.onsemi.com/pub/Collateral/TL431-D.PDF?src-supplier=Avnet+Europe; ComponentLink5Description: http://www.onsemi.com/pub/Collateral/TL431-D.PDF?src-supplier=Avnet+Europe; Category: Integrated Circuits
VR1 = P6KE200A-E3/54: DIODE TVS 171VWM 274VC DO204AC; Manufacturer: Vishay Semiconductors; Number of Elements: 1; Direction: Unidirectional; Operating Supply Voltage: 171V; Max Surge Current: 2.2A; Reverse Breakdown Voltage: 190V; Clamping Voltage: 274V; Peak Pulse Power: 600W; Test Current: 1mA; ESD Protection: Yes; Max Reverse Leakage Current: 1uA; Max Breakdown Voltage: 210V; Element Configuration: Single; Forward Voltage: 5V; Supplier 1: Digi-Key; Supplier Part Number 1: P6KE200A-E3/54GICT-ND; Manufacturer Part Number: P6KE200A-E3/54; Stock 1: 7709; Mount: Through Hole; Case/Package: DO-15; Number of Pins: 2; Min Operating Temperature: -65°C; Max Operating Temperature: 175°C; Packaging: Tape and Reel; Package Quantity: 4000; Reverse Standoff Voltage: 171V; Polarity: Unidirectional; Breakdown Voltage: 190V; Number of Channels: 1; Termination: Axial; Peak Pulse Current: 2.2A; Min Breakdown Voltage: 190V; Power Dissipation: 600W; Max Power Dissipation: 600W; Leakage Current: 1uA; Max Output Current: 2.2A; Diameter: 3.6mm; Length: 7.6mm; Radiation Hardening: No; REACH SVHC: Unknown; Lead Free: Lead Free; ComponentLink1URL: http://www.vishay.com/docs/88369/p6ke.pdf?src-supplier=Avnet+Europe; ComponentLink1Description: http://www.vishay.com/docs/88369/p6ke.pdf?src-supplier=Avnet+Europe; ComponentLink2URL: http://www.vishay.com/docs/88369/p6ke.pdf?src-supplier=Avnet; ComponentLink2Description: http://www.vishay.com/docs/88369/p6ke.pdf?src-supplier=Avnet; ComponentLink3URL: http://www.vishay.com/docs/88369/p6ke.pdf?src-supplier=Digi-Key; ComponentLink3Description: http://www.vishay.com/docs/88369/p6ke.pdf?src-supplier=Digi-Key; ComponentLink4URL: http://components.arrow.com/part/dataview/42814345S7553311N5680?src-supplier=Arrow; ComponentLink4Description: http://components.arrow.com/part/dataview/42814345S7553311N5680?src-supplier=Arrow; ComponentLink5URL: http://www.farnell.com/datasheets/1911693.pdf?src-supplier=Element14; ComponentLink5Description: http://www.farnell.com/datasheets/1911693.pdf?src-supplier=Element14; ComponentLink6URL: http://www.vishay.com/docs/88369/p6ke.pdf?src-supplier=Future+Electronics; ComponentLink6Description: http://www.vishay.com/docs/88369/p6ke.pdf?src-supplier=Future+Electronics; ComponentLink7URL: https://www.verical.com/server-webapp/html/getDatasheet?partID=84740&src-supplier=Verical; ComponentLink7Description: https://www.verical.com/server-webapp/html/getDatasheet?partID=84740&src-supplier=Verical; Category: Diodes
X1-X4 = Power Terminal

## Sheet Board Layout Recommendations.SchDoc
size A
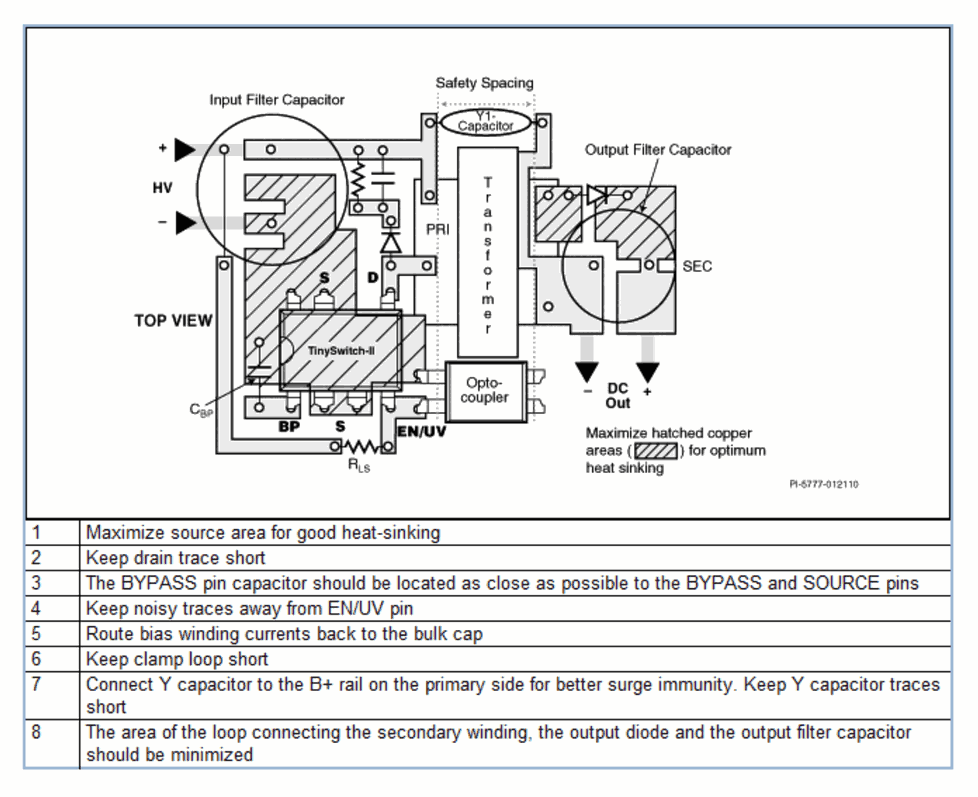
[diagram p1: Board Layout Recommendations.SchDoc]